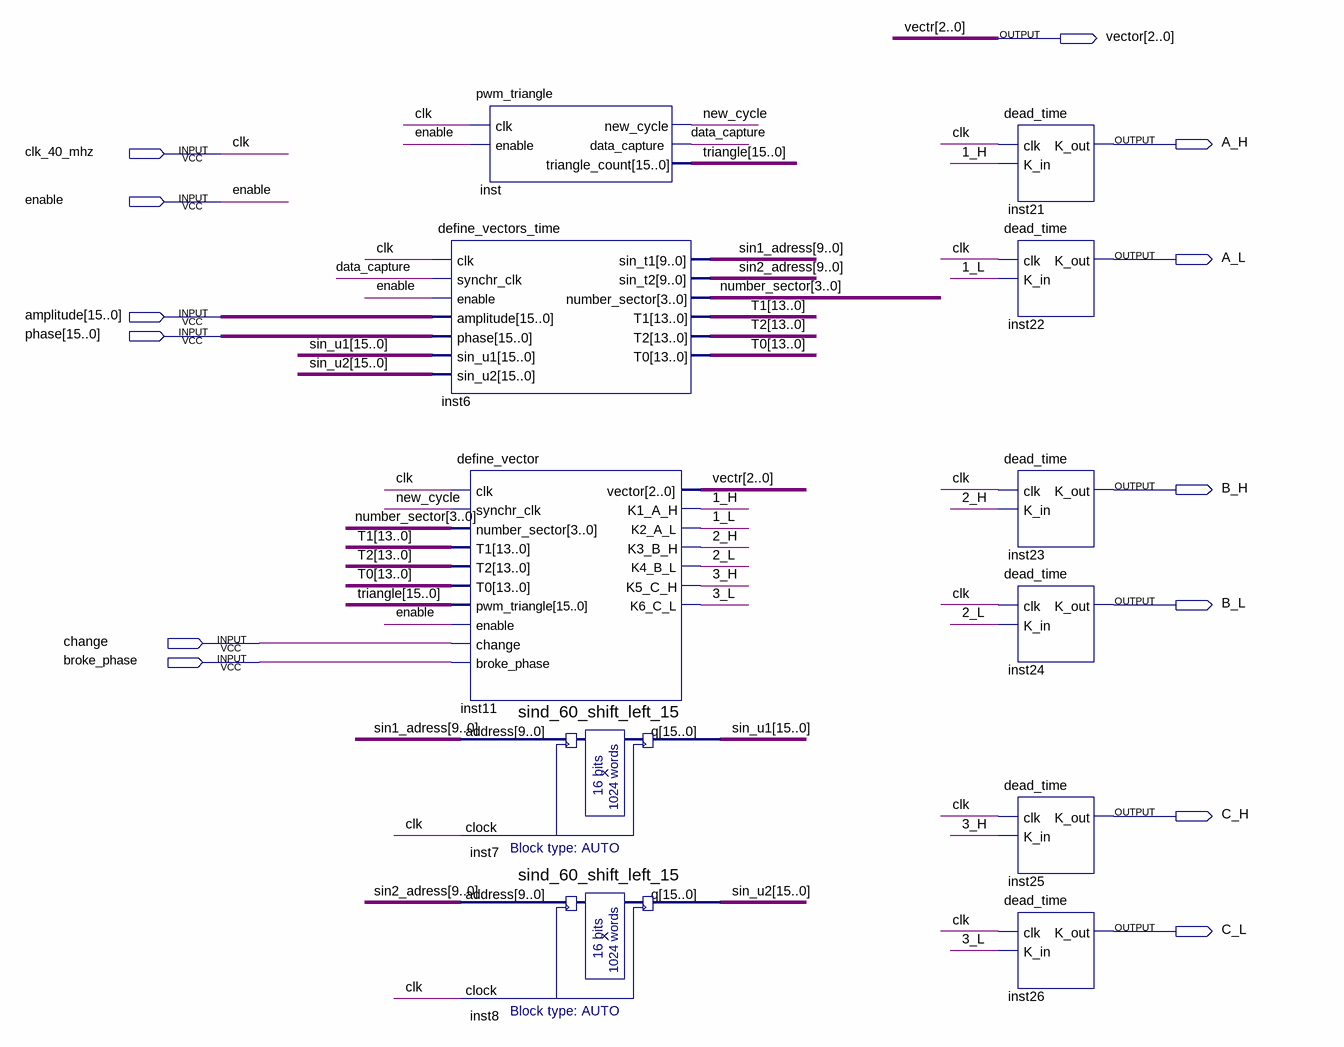
[diagram p0: schematic sheet]
// Quartus schematic SVM_2_level.bdf as structural Verilog: 11 symbols, 13 pins
module SVM_2_level (
  input  clk_40_mhz,
  input  enable,
  input  [15:0] amplitude,
  input  [15:0] phase,
  input  change,
  input  broke_phase,
  output [2:0] vector,
  output A_H,
  output A_L,
  output B_H,
  output B_L,
  output C_H,
  output C_L
);

  wire \1_H , \1_L , \2_H , \2_L , \3_H , \3_L , data_capture, new_cycle;
  wire [3:0] number_sector;
  wire [9:0] sin1_adress, sin2_adress;
  wire [13:0] T0, T1, T2;
  wire [15:0] sin_u1, sin_u2, triangle;

  pwm_triangle inst (
    .clk(clk_40_mhz), .enable(enable), .new_cycle(new_cycle), .data_capture(data_capture),
    .triangle_count(triangle));
  define_vectors_time inst6 (
    .clk(clk_40_mhz), .synchr_clk(data_capture), .enable(enable), .amplitude(amplitude), .phase(phase),
    .sin_u1(sin_u1), .sin_u2(sin_u2), .sin_t1(sin1_adress), .sin_t2(sin2_adress),
    .number_sector(number_sector), .T1(T1), .T2(T2), .T0(T0));
  define_vector inst11 (
    .clk(clk_40_mhz), .synchr_clk(new_cycle), .number_sector(number_sector), .T1(T1), .T2(T2), .T0(T0),
    .pwm_triangle(triangle), .enable(enable), .change(change), .broke_phase(broke_phase), .vector(vector),
    .K1_A_H(\1_H ), .K2_A_L(\1_L ), .K3_B_H(\2_H ), .K4_B_L(\2_L ), .K5_C_H(\3_H ), .K6_C_L(\3_L ));
  sind_60_shift_left_15 inst7 (.address(sin1_adress), .clock(clk_40_mhz), .q(sin_u1));
  sind_60_shift_left_15 inst8 (.address(sin2_adress), .clock(clk_40_mhz), .q(sin_u2));
  dead_time inst21 (.clk(clk_40_mhz), .K_in(\1_H ), .K_out(A_H));
  dead_time inst22 (.clk(clk_40_mhz), .K_in(\1_L ), .K_out(A_L));
  dead_time inst23 (.clk(clk_40_mhz), .K_in(\2_H ), .K_out(B_H));
  dead_time inst24 (.clk(clk_40_mhz), .K_in(\2_L ), .K_out(B_L));
  dead_time inst25 (.clk(clk_40_mhz), .K_in(\3_H ), .K_out(C_H));
  dead_time inst26 (.clk(clk_40_mhz), .K_in(\3_L ), .K_out(C_L));

  // Other names for the same wires on the sheet: clk = clk_40_mhz; vectr[2:0] = vector
endmodule
